# EAGLE design tick-display-mk-3-mini (EAGLE 6.5.0)
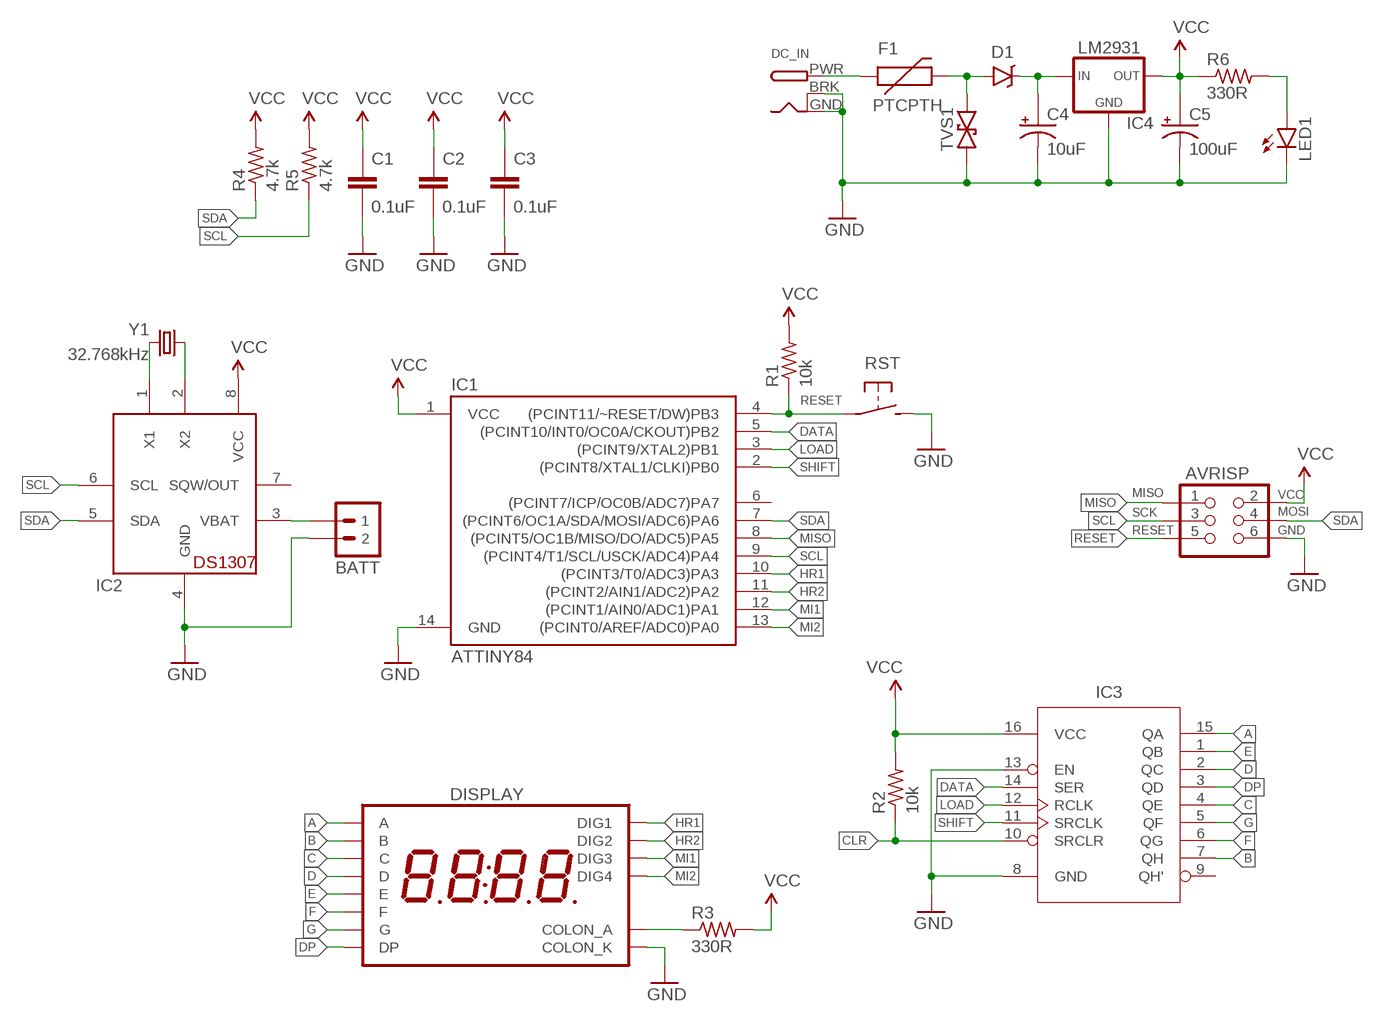
[diagram p0: schematic, sheet 1]

## Parts
AVRISP  AVR_SPI_PRG_6PTH  [2X3]
BATT  M02JST-PTH-VERT  [JST-2-PH-VERT-PTH]
C1  0.1uF  CAPACITOR-CERAMIC025-024X044  [C025-024X044]
C2  0.1uF  CAPACITOR-CERAMIC025-024X044  [C025-024X044]
C3  0.1uF  CAPACITOR-CERAMIC025-024X044  [C025-024X044]
C4  10uF  CAPACITOR-POLARIZEDE2.5-6  [E2,5-6]
C5  100uF  CAPACITOR-POLARIZEDE2.5-6  [E2,5-6]
D1  1N5819  DIODE-SCHOTTKYPTH-7.68MM  [DIODE-7.68MM]
DC_IN  DCBARRELPTH  [DCJACK_2MM_PTH]
DISPLAY  7SED_4DIGIT_14MM14.2MM-CC-NS  [7SEG_4DIG_NS]
F1  PTCPTH  [PTC]
IC1  ATTINY84  ATTINY84ATTINY84-20PU  [DIL14]
IC2  DS1307  [DIL08]
IC3  74HCT595  74595DIP  [DIL16]
IC4  LM2931  V_REG_78XXTO-92-INLINE  [TO-92-AMMO]
LED1  LED3MM  [LED3MM]
R1  10k  RESISTORPTH-AXIAL-5.08MM  [RESISTOR-AXIAL-PTH-5.08MM]
R2  10k  RESISTORPTH-AXIAL-5.08MM  [RESISTOR-AXIAL-PTH-5.08MM]
R3  330R  RESISTORPTH-AXIAL-5.08MM  [RESISTOR-AXIAL-PTH-5.08MM]
R4  4.7k  RESISTORPTH-AXIAL-5.08MM  [RESISTOR-AXIAL-PTH-5.08MM]
R5  4.7k  RESISTORPTH-AXIAL-5.08MM  [RESISTOR-AXIAL-PTH-5.08MM]
R6  330R  RESISTORPTH-AXIAL-5.08MM  [RESISTOR-AXIAL-PTH-5.08MM]
RST  SPST-NO-TACT3MM-RA  [TACTILE-PTH-SIDE]
TVS1  TVSDO-41-TVS-BIDIRECTIONAL  [DO-41-TVS]
Y1  32.768kHz  CRYSTALTC26H  [TC26H]

## Nets
A: DISPLAY.P$13(A) IC3.15(QA)
B: DISPLAY.P$9(B) IC3.7(QH)
C: DISPLAY.P$4(C) IC3.4(QE)
CLR: IC3.10(SRCLR) R2.P$1
D: DISPLAY.P$2(D) IC3.2(QC)
DATA: IC1.5((PCINT10/INT0/OC0A/CKOUT)PB2) IC3.14(SER)
DP: DISPLAY.P$3(DP) IC3.3(QD)
E: DISPLAY.P$1(E) IC3.1(QB)
F: DISPLAY.P$12(F) IC3.6(QG)
G: DISPLAY.P$5(G) IC3.5(QF)
GND: AVRISP.6(GND) BATT.2 C1.2 C2.2 C3.2 C4.- C5.- DC_IN.BRK DC_IN.GND DISPLAY.P$7(COLON_K) IC1.14(GND) IC2.4(GND) IC3.8(GND) IC3.13(EN) IC4.2(GND) LED1.K(C) RST.2 TVS1.P$1
HR1: DISPLAY.P$14(DIG1) IC1.10((PCINT3/T0/ADC3)PA3)
HR2: DISPLAY.P$11(DIG2) IC1.11((PCINT2/AIN1/ADC2)PA2)
LOAD: IC1.3((PCINT9/XTAL2)PB1) IC3.12(RCLK)
MI1: DISPLAY.P$10(DIG3) IC1.12((PCINT1/AIN0/ADC1)PA1)
MI2: DISPLAY.P$6(DIG4) IC1.13((PCINT0/AREF/ADC0)PA0)
MISO: AVRISP.1(MISO) IC1.8((PCINT5/OC1B/MISO/DO/ADC5)PA5)
N$1: BATT.1 IC2.3(VBAT)
N$3: DC_IN.PWR F1.P$1
N$4: D1.A F1.P$2 TVS1.P$2
N$5: C4.+ D1.K(C) IC4.1(IN)
N$7: IC2.1(X1) Y1.2
N$8: IC2.2(X2) Y1.1
N$10: LED1.A R6.P$2
N$18: DISPLAY.P$8(COLON_A) R3.P$1
RESET: AVRISP.5(RESET) IC1.4((PCINT11/~RESET/DW)PB3) R1.P$1 RST.1
SCL: AVRISP.3(SCK) IC1.9((PCINT4/T1/SCL/USCK/ADC4)PA4) IC2.6(SCL) R5.P$1
SDA: AVRISP.4(MOSI) IC1.7((PCINT6/OC1A/SDA/MOSI/ADC6)PA6) IC2.5(SDA) R4.P$1
SHIFT: IC1.2((PCINT8/XTAL1/CLKI)PB0) IC3.11(SRCLK)
VCC: AVRISP.2(VCC) C1.1 C2.1 C3.1 C5.+ IC1.1(VCC) IC2.8(VCC) IC3.16(VCC) IC4.3(OUT) R1.P$2 R2.P$2 R3.P$2 R4.P$2 R5.P$2 R6.P$1
Unconnected: IC1.6((PCINT7/ICP/OC0B/ADC7)PA7) IC2.7(SQW/OUT) IC3.9(QH')

## Library data of the parts
AVRISP = A_butts:AVR_SPI_PRG_6: AVR ISP 6 Pin This is the reduced ISP connector for AVR programming. Common on Arduino. This footprint will take up less PCB space and can be used with a 10-pin to 6-pin adapter such as SKU: BOB-08508 **Special note about "TEST_POINT" package. The stop mask is on the top side, so if you want your programming test points to be on the bottom of your board, make sure to place this package on the bottom side of the board. This also ensure that the orientation to program from the bottom side will be correct.
BATT = A_butts:M02: Standard 2-pin 0.1" header. Use with - straight break away headers ( PRT-00116) - right angle break away headers (PRT-00553) - swiss pins (PRT-00743) - machine pins (PRT-00117) - female headers (PRT-00115) Molex polarized connector foot print use with: PRT-08233 with associated crimp pins and housings. 2.54_SCREWTERM for use with PRT-10571. 3.5mm Screw Terminal footprints for PRT-08084 5mm Screw Terminal footprints for use with PRT-08433
C1-C3 = A_butts:CAPACITOR-CERAMIC: CAPACITOR, European symbol
C4 C5 = A_butts:CAPACITOR-POLARIZED: POLARIZED CAPACITOR, American symbol
D1 = A_butts:DIODE-SCHOTTKY: Schottky diodes in SFE's production catalog BAT20J 1A 23V 0.62Vf RB751 120mA 40V 0.37Vf PMEG4005EJ 0.5A 40V 0.42Vf MBRA140 1A 40V 0.5Vf B340A 3A 40V SMA
DC_IN = A_butts:DCBARREL: 2.0mm DC Barrel Jack DCJACK_2MM_PTH - Through Hole Jack (4UConnector: 05537)
DISPLAY = A_butts:7SED_4DIGIT_14MM
F1 = A_butts:PTC: Resettable Fuse PTC Resettable Fuse. Spark Fun Electronics SKU : COM-08357
IC1 = A_butts:ATTINY84: Atmel 14-pin 2/4/8kB flash uC
IC2 = A_butts:DS1307: DS1307 Real time clock (RTC) with battery backup ability. Talk to it via i2c
IC3 = A_butts:74*595
IC4 = A_butts:V_REG_78XX: Voltage Regulator Standard 7805 5V regulator. IGO (Input Ground Output). Spark Fun Electronics SKU : COM-00107
LED1 = A_butts:LED: LEDs Standard schematic elements and footprints for 5mm, 3mm, 1206, and 0603 sized LEDs. 5mm - Spark Fun Electronics SKU : COM-00529 (and others)
R1-R6 = A_butts:RESISTOR: RESISTOR, American symbol
RST = A_butts:SPST-NO-TACT
TVS1 = A_butts:TVS: Transient voltage suppressor- prevents ESD on inputs. Ignore package description- MBRA140 is NOT this type of part!!!
Y1 = A_butts:CRYSTAL: Various standard crystals. Proven footprints. Spark Fun Electronics SKU : COM-00534

## Board
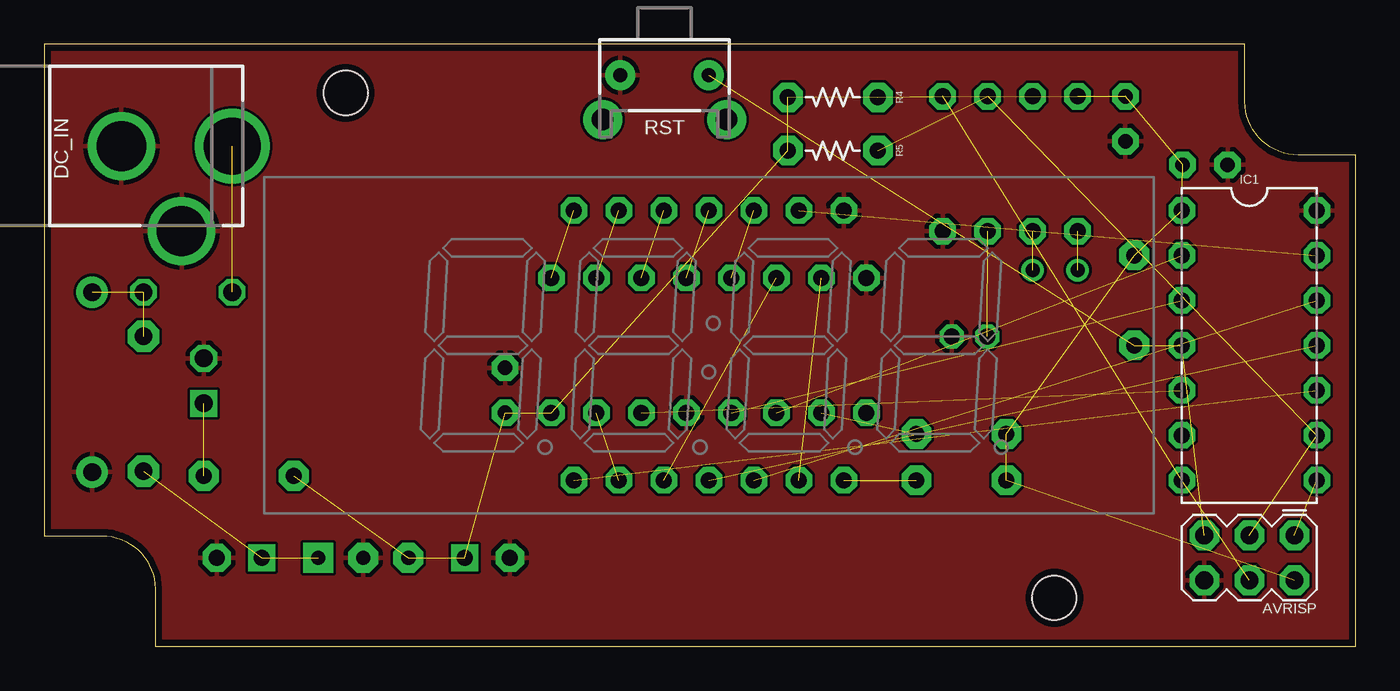
[diagram p1: board, top side]
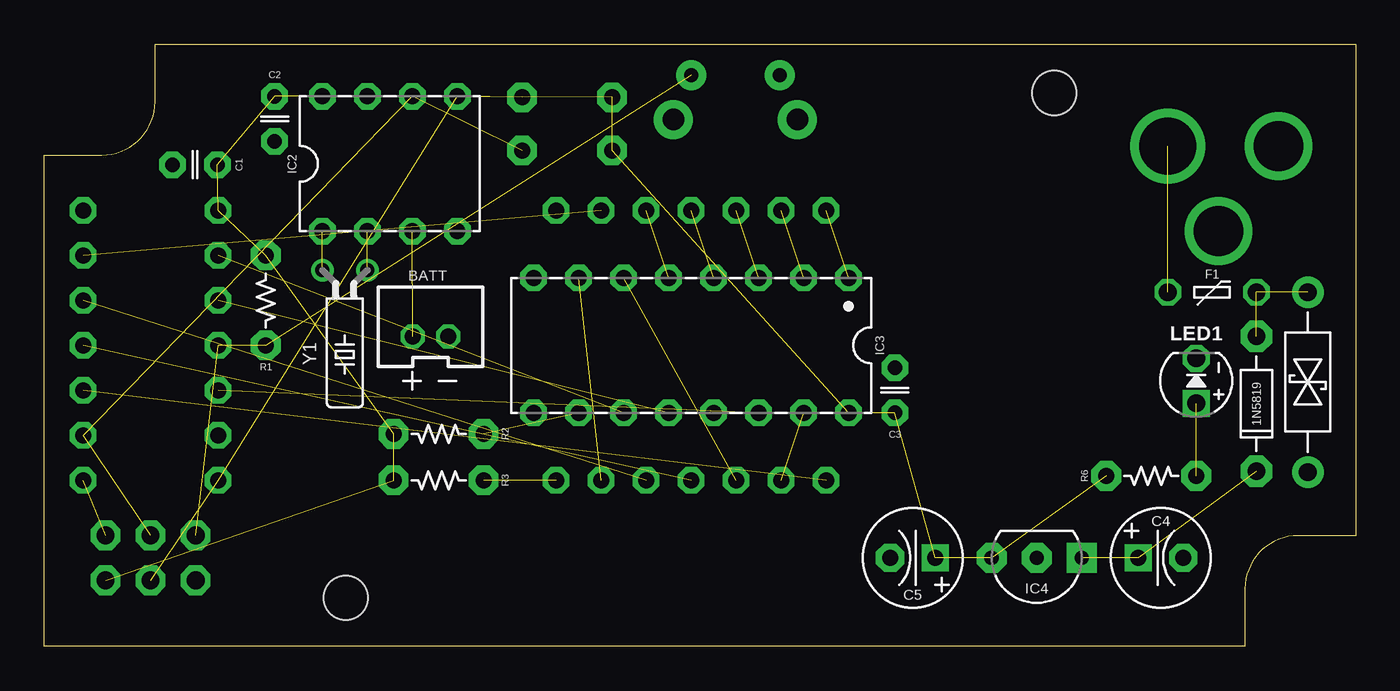
[diagram p2: board, bottom side, seen from below]

Size 74 x 34 mm. Coordinates in mm from the lower left corner, seen from the top.
Outline: 67.75,30.75 67.75,34 0,34 0,6.25 3.25,6.25 arc-90 6.25,3.25 6.25,0 74,0 74,27.75 70.75,27.75 arc-90 67.75,30.75
Copper layers (1*16): Top 0.0356mm / dielectric 1.5011mm / Bottom 0.0356mm
Design rules "LaenPCBOrder2": minimum track width 6mil, minimum drill 13mil, track to track 6mil, track to pad 6mil, pad to pad 6mil, via to via 6mil, smd to smd 6mil, copper to edge 15mil, drill to drill 6mil, minimum pad ring 7mil, minimum via ring 7mil, stop-mask expansion 3mil, vias tented up to drill 20mil, thermal gap 10mil
Holes 2.5 mm at 17,31.25 57,2.75

### Footprints (pad centres in the part's own frame; a part is rotated, then mirrored left to right if it is on the bottom)
2X3 = drill 1 pad 1.676 octagon: 1 -2.54,-1.27; 2 -2.54,1.27; 3 0,-1.27; 4 0,1.27; 5 2.54,-1.27; 6 2.54,1.27
JST-2-PH-VERT-PTH = drill 0.9 octagon: 1 -1,0; 2 1,0
C025-024X044 = drill 0.813 pad 1.5 octagon: 1 -1.27,0; 2 1.27,0
E2,5-6 = drill 0.9 pad 1.524 square: + -1.27,0 | drill 0.9 pad 1.6 octagon: - 1.27,0
DIODE-7.68MM = drill 1 pad 1.778 octagon: A -3.81,0; K 3.81,0
DCJACK_2MM_PTH = drill 2.8: BRK 4.8,10.75; GND 0,7.35 | drill 3.2: PWR 0,13.6
7SEG_4DIG_NS = drill 0.9 pad 1.5 octagon: P$1 -7.62,7.62; P$2 -5.08,7.62; P$3 -2.54,7.62; P$4 0,7.62; P$5 2.54,7.62; P$6 5.08,7.62; P$7 7.62,7.62; P$8 7.62,-7.62; P$9 5.08,-7.62; P$10 2.54,-7.62; P$11 0,-7.62; P$12 -2.54,-7.62; P$13 -5.08,-7.62; P$14 -7.62,-7.62
PTC = drill 1 pad 1.5 octagon: P$1 -2.5,0; P$2 2.5,0
DIL14 = drill 0.9 pad 1.5 octagon: 1 -7.62,-3.81; 2 -5.08,-3.81; 3 -2.54,-3.81; 4 0,-3.81; 5 2.54,-3.81; 6 5.08,-3.81; 7 7.62,-3.81; 8 7.62,3.81; 9 5.08,3.81; 10 2.54,3.81; 11 0,3.81; 12 -2.54,3.81; 13 -5.08,3.81; 14 -7.62,3.81
DIL08 = drill 0.9 pad 1.5 octagon: 1 -3.81,-3.81; 2 -1.27,-3.81; 3 1.27,-3.81; 4 3.81,-3.81; 5 3.81,3.81; 6 1.27,3.81; 7 -1.27,3.81; 8 -3.81,3.81
DIL16 = drill 0.9 pad 1.5 octagon: 1 -8.89,-3.81; 2 -6.35,-3.81; 3 -3.81,-3.81; 4 -1.27,-3.81; 5 1.27,-3.81; 6 3.81,-3.81; 7 6.35,-3.81; 8 8.89,-3.81; 9 8.89,3.81; 10 6.35,3.81; 11 3.81,3.81; 12 1.27,3.81; 13 -1.27,3.81; 14 -3.81,3.81; 15 -6.35,3.81; 16 -8.89,3.81
TO-92-AMMO = drill 0.813 pad 1.676 square: 1 -2.54,0 | drill 0.813 pad 1.676 octagon: 2 0,0; 3 2.54,0
LED3MM = drill 1 pad 1.524 square: A -1.27,0 | drill 1 pad 1.524 octagon: K 1.27,0
RESISTOR-AXIAL-PTH-5.08MM = drill 0.9 pad 1.676 octagon: P$1 -2.54,0; P$2 2.54,0
TACTILE-PTH-SIDE = drill 0.8 pad 1.7: 1 -2.5,0; 2 2.5,0 | drill 1.2 pad 2.2: ANCHOR1 -3.5,2.5; ANCHOR2 3.5,2.5
DO-41-TVS = drill 1 pad 1.778: P$1 -5.08,0; P$2 5.08,0
TC26H = drill 0.8 pad 1.27: 1 -1.27,0; 2 1.27,0

### Placement (x,y rotation side)
AVRISP  68,5 180 top
BATT  52.2,17.5 0 bottom
C1  65.5,27.19 180 bottom
C2  61,29.79 270 bottom
C3  26,14.46 90 bottom
C4  11,5 0 bottom
C5  25,5 180 bottom
D1  5.6,13.7 270 bottom
DC_IN  -3,28.25 270 top
DISPLAY  37.5,17 0 top
F1  8.1,20 0 bottom
IC1  68,17 270 top
IC2  54.5,27.25 0 bottom
IC3  37.5,17 180 bottom
IC4  18,5 180 bottom
LED1  9,15 90 bottom
R1  61.5,19.54 90 bottom
R2  51.75,12 180 bottom
R3  51.75,9.38 180 bottom
R4  44.5,31 180 top
R5  44.5,28 180 top
R6  11.54,9.63 0 bottom
RST  35,32.25 180 top
TVS1  2.7,14.92 90 bottom
Y1  57.04,21.25 180 bottom

### Tracks (layer width: path | path; a pad name or v marks a point on that pad's centre or on a via)
A  (1 unrouted)
B  (1 unrouted)
C  (1 unrouted)
CLR  (1 unrouted)
D  (1 unrouted)
DATA  (1 unrouted)
DP  (1 unrouted)
E  (1 unrouted)
F  (1 unrouted)
G  (1 unrouted)
GND
  pour Top: 74,34 74,0 0,0 0,34
HR1  (1 unrouted)
HR2  (1 unrouted)
LOAD  (1 unrouted)
MI1  (1 unrouted)
MI2  (1 unrouted)
MISO  (1 unrouted)
N$1  (1 unrouted)
N$3  (1 unrouted)
N$4  (2 unrouted)
N$5  (2 unrouted)
N$7  (1 unrouted)
N$8  (1 unrouted)
N$10  (1 unrouted)
N$18  (1 unrouted)
RESET  (3 unrouted)
SCL  (3 unrouted)
SDA  (3 unrouted)
SHIFT  (1 unrouted)
VCC  (14 unrouted)